# Altium schematic sheet 模电.SchDoc
size A4
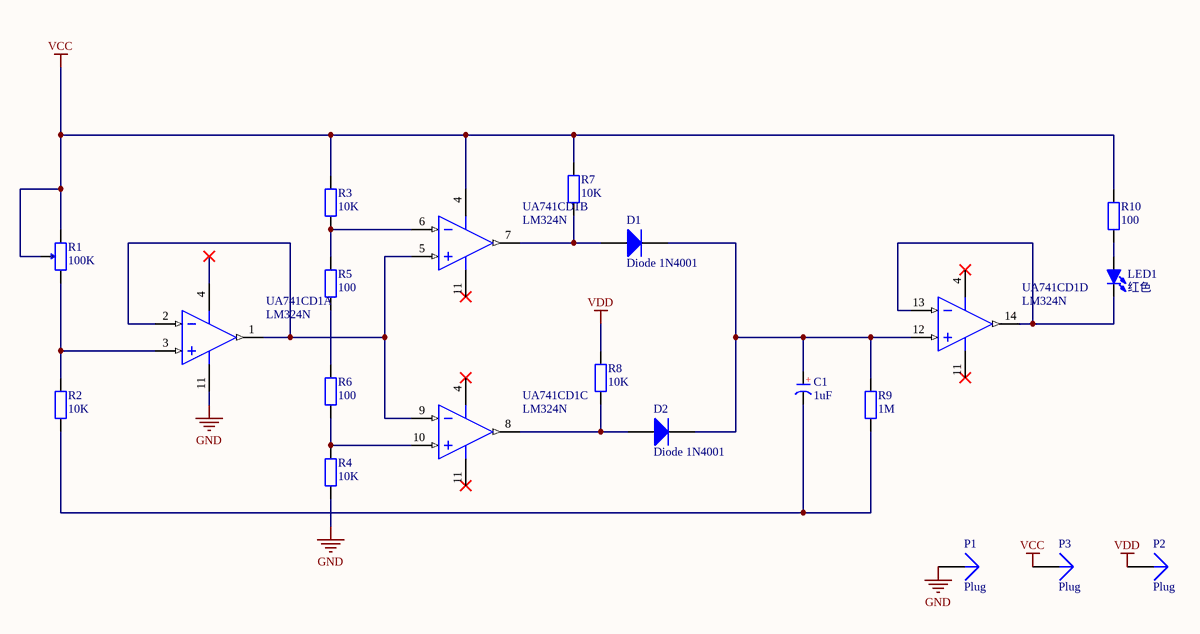
[diagram p0: 模电.SchDoc]

## Parts
C1  1uF  [CAP 1.5*4*8]
D1  Diode 1N4001  [DO-41]
D2  Diode 1N4001  [DO-41]
LED1  红色  [LED 3MM-B]
P1  Plug  [PIN1]
P2  Plug  [PIN1]
P3  Plug  [PIN1]
R1  100K  [3362P]
R2  10K  [RS 1/4W]
R3  10K  [RS 1/4W]
R4  10K  [RS 1/4W]
R5  100  [RS 1/4W]
R6  100  [RS 1/4W]
R7  10K  [RS 1/4W]
R8  10K  [RS 1/4W]
R9  1M  [RS 1/4W]
R10  100  [RS 1/4W]
UA741CD1  LM324N  [DIP14]  (parts A,B,C,D of 4)

## Nets
GND: P1.1 R4.1 UA741CD1.11(GND)
VCC: P3.1 R1.2 R1.3 R3.2 R7.2 R10.2 UA741CD1.4(V+)
VDD: P2.1 R8.2
NetC1_1: C1.1(A) D1.2(K) D2.2(K) R9.2 UA741CD1.12(IN4+)
NetC1_2: C1.2(K) R2.1 R9.1
NetD1_1: D1.1(A) R7.1 UA741CD1.7(OUT2)
NetD2_1: D2.1(A) R8.1 UA741CD1.8(OUT3)
NetLED1_1: LED1.1(A) R10.1
NetLED1_2: LED1.2(K) UA741CD1.13(IN4-) UA741CD1.14(OUT4)
NetR1_1: R1.1 R2.2 UA741CD1.3(IN1+)
NetR3_1: R3.1 R5.2 UA741CD1.6(IN2-)
NetR4_2: R4.2 R6.1 UA741CD1.10(IN3+)
NetR5_1: R5.1 R6.2
NetUA741CD1_1: UA741CD1.1(OUT1) UA741CD1.2(IN1-) UA741CD1.5(IN2+) UA741CD1.9(IN3-)

## Notes on the sheet
- (in symbol C-CAP) +

## Library data of the parts
C1 = C-CAP: 直插电解电容; 淘宝ID: 黄晶宝石; BOM名称: 直插电解电容; 学习资源: https://shop463601444.taobao.com
D1 D2 = Diode 1N4001: 1 Amp General Purpose Rectifier; Published: 8-Jun-2000; LatestRevisionDate: 17-Jul-2002; LatestRevisionNote: Re-released for DXP Platform.; DatasheetVersion: 1998; PackageVersion: Aug-1999; PackageReference: DO-41; Publisher: Altium Limited; PackageDescription: Diode, Axial; Body 5.2 x 2.7 mm (LxDia. max), Lead Dia. 0.86 mm (max); Code_JEDEC: DO-204-AL; ComponentLink1Description: Manufacturer Link; ComponentLink1URL: http://www.fairchildsemi.com/; ComponentLink2Description: Datasheet; ComponentLink2URL: http://www.fairchildsemi.com/ds/1N%2F1N4001.pdf
LED1 = LED-3MM: 插件LED; 版权归属: 源创客; BOM名称: 插件LED; 学习资源: www.ooocke.com
R1 = RP-SMD: 贴片电位器; 版权归属: 源创客; BOM名称: 贴片电位器; 学习资源: https://shop463601444.taobao.com
R2-R10 = R-CRR: 直插色环电阻; BOM名称: 色环电阻; 版权归属: 源创客; 学习资源: https://shop463601444.taobao.com
UA741CD1 = LM324N: Low Power Quad Operational Amplifier, 14-pin MDIP; Manufacturer: National Semiconductor; PackageTopMarking: NSUZXYYTTE#*LM324N; PowerWise: N; CompType: Amplifiers; Published: 4-Dec-2008; LatestRevisionDate: 13-Jan-2009; LatestRevisionNote: Sim Model Added.; DatasheetVersion: Aug-2000; PackageVersion: revG, May-2006; PackageReference: N14A; Publisher: Altium Limited; PackageDescription: MDIP, .750 x .250 x.130in, 14 Lead, .100in Pitch; PartNumber: LM324N; RoHS: N; PinCount: 14; Code_JEDEC: MS-001-AA; ComponentLink1Description: LM324 Datasheet; ComponentLink1URL: http://www.national.com/ds/LM/LM324.pdf; ComponentLink2Description: LM324 Web Page; ComponentLink2URL: http://www.national.com/pf/LM/LM324.html; ComponentLink3Description: N14A Package Page; ComponentLink3URL: http://www.national.com/packaging/folders/n14a.html
P1-P3 = Plug: LatestRevisionDate: 17-Jul-2002; LatestRevisionNote: Re-released for DXP Platform.; Publisher: Altium Limited